# Altium schematic sheet PwrAndBias.SchDoc: XTRX. SDR mini PCIe Transceiver.
size A3; CompanyName: Fairwaves Inc.; DrawnBy: Andrey Sviyazov; Revision: 4; SheetNumber: 4; SheetTotal: 5
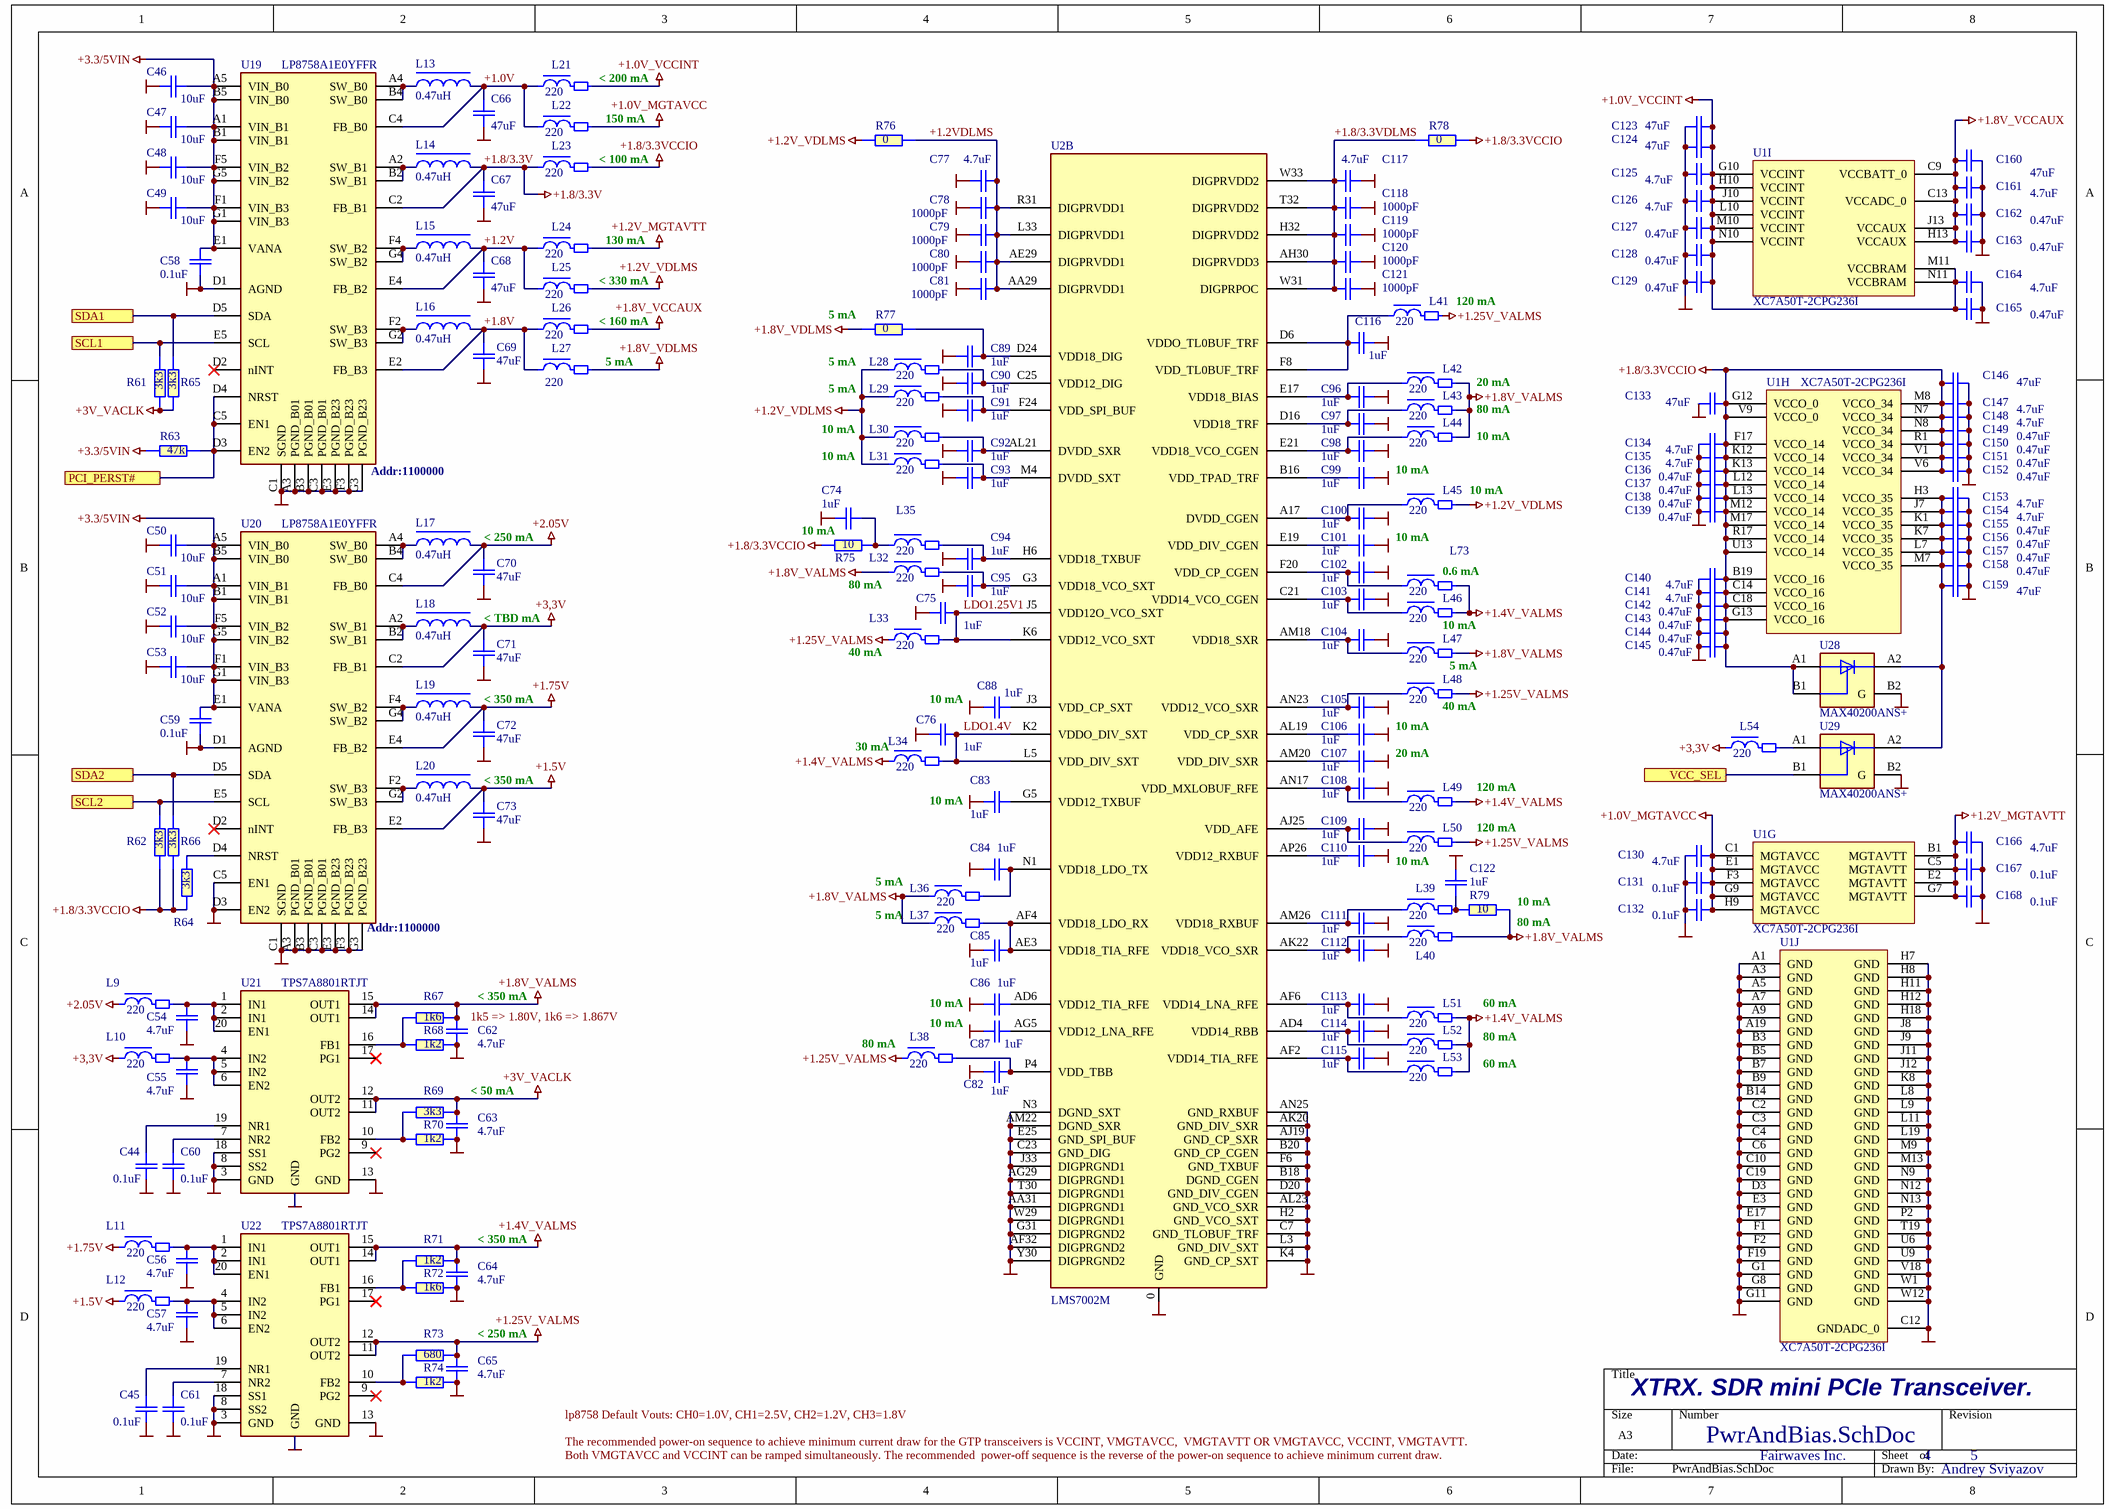
[diagram p0: PwrAndBias.SchDoc]

## Parts
C44  0.1uF  [C0402-cirq]
C45  0.1uF  [C0402-cirq]
C46  10uF  [C0603-Phillips]
C47  10uF  [C0603-Phillips]
C48  10uF  [C0603-Phillips]
C49  10uF  [C0603-Phillips]
C50  10uF  [C0603-Phillips]
C51  10uF  [C0603-Phillips]
C52  10uF  [C0603-Phillips]
C53  10uF  [C0603-Phillips]
C54  4.7uF  [C0402-cirq]
C55  4.7uF  [C0402-cirq]
C56  4.7uF  [C0402-cirq]
C57  4.7uF  [C0402-cirq]
C58  0.1uF  [C0402-cirq]
C59  0.1uF  [C0402-cirq]
C60  0.1uF  [C0402-cirq]
C61  0.1uF  [C0402-cirq]
C62  4.7uF  [C0402-cirq]
C63  4.7uF  [C0402-cirq]
C64  4.7uF  [C0402-cirq]
C65  4.7uF  [C0402-cirq]
C66  47uF  [C0603 tall]
C67  47uF  [C0603 tall]
C68  47uF  [C0603 tall]
C69  47uF  [C0603 tall]
C70  47uF  [C0603 tall]
C71  47uF  [C0603 tall]
C72  47uF  [C0603 tall]
C73  47uF  [C0603 tall]
C74  1uF  [C0402-cirq]
C75  1uF  [C0402-cirq]
C76  1uF  [C0402-cirq]
C77  4.7uF  [C0402-cirq]
C78  1000pF  [C0402-cirq]
C79  1000pF  [C0402-cirq]
C80  1000pF  [C0402-cirq]
C81  1000pF  [C0402-cirq]
C82  1uF  [C0402-cirq]
C83  1uF  [C0402-cirq]
C84  1uF  [C0402-cirq]
C85  1uF  [C0402-cirq]
C86  1uF  [C0402-cirq]
C87  1uF  [C0402-cirq]
C88  1uF  [C0402-cirq]
C89  1uF  [C0402-cirq]
C90  1uF  [C0402-cirq]
C91  1uF  [C0402-cirq]
C92  1uF  [C0402-cirq]
C93  1uF  [C0402-cirq]
C94  1uF  [C0402-cirq]
C95  1uF  [C0402-cirq]
C96  1uF  [C0402-cirq]
C97  1uF  [C0402-cirq]
C98  1uF  [C0402-cirq]
C99  1uF  [C0402-cirq]
C100  1uF  [C0402-cirq]
C101  1uF  [C0402-cirq]
C102  1uF  [C0402-cirq]
C103  1uF  [C0402-cirq]
C104  1uF  [C0402-cirq]
C105  1uF  [C0402-cirq]
C106  1uF  [C0402-cirq]
C107  1uF  [C0402-cirq]
C108  1uF  [C0402-cirq]
C109  1uF  [C0402-cirq]
C110  1uF  [C0402-cirq]
C111  1uF  [C0402-cirq]
C112  1uF  [C0402-cirq]
C113  1uF  [C0402-cirq]
C114  1uF  [C0402-cirq]
C115  1uF  [C0402-cirq]
C116  1uF  [C0402-cirq]
C117  4.7uF  [C0402-cirq]
C118  1000pF  [C0402-cirq]
C119  1000pF  [C0402-cirq]
C120  1000pF  [C0402-cirq]
C121  1000pF  [C0402-cirq]
C122  1uF  [C0402-cirq]
C123  47uF  [C0603 tall]
C124  47uF  [C0603 tall]
C125  4.7uF  [C0402-cirq]
C126  4.7uF  [C0402-cirq]
C127  0.47uF  [C0402-cirq]
C128  0.47uF  [C0402-cirq]
C129  0.47uF  [C0402-cirq]
C130  4.7uF  [C0402-cirq]
C131  0.1uF  [C0402-cirq]
C132  0.1uF  [C0402-cirq]
C133  47uF  [C0603 tall]
C134  4.7uF  [C0402-cirq]
C135  4.7uF  [C0402-cirq]
C136  0.47uF  [C0402-cirq]
C137  0.47uF  [C0402-cirq]
C138  0.47uF  [C0402-cirq]
C139  0.47uF  [C0402-cirq]
C140  4.7uF  [C0402-cirq]
C141  4.7uF  [C0402-cirq]
C142  0.47uF  [C0402-cirq]
C143  0.47uF  [C0402-cirq]
C144  0.47uF  [C0402-cirq]
C145  0.47uF  [C0402-cirq]
C146  47uF  [C0603 tall]
C147  4.7uF  [C0402-cirq]
C148  4.7uF  [C0402-cirq]
C149  0.47uF  [C0402-cirq]
C150  0.47uF  [C0402-cirq]
C151  0.47uF  [C0402-cirq]
C152  0.47uF  [C0402-cirq]
C153  4.7uF  [C0402-cirq]
C154  4.7uF  [C0402-cirq]
C155  0.47uF  [C0402-cirq]
C156  0.47uF  [C0402-cirq]
C157  0.47uF  [C0402-cirq]
C158  0.47uF  [C0402-cirq]
C159  47uF  [C0603 tall]
C160  47uF  [C0603 tall]
C161  4.7uF  [C0402-cirq]
C162  0.47uF  [C0402-cirq]
C163  0.47uF  [C0402-cirq]
C164  4.7uF  [C0402-cirq]
C165  0.47uF  [C0402-cirq]
C166  4.7uF  [C0402-cirq]
C167  0.1uF  [C0402-cirq]
C168  0.1uF  [C0402-cirq]
L9  220  [BEAD0402-Phillips]
L10  220  [BEAD0402-Phillips]
L11  220  [BEAD0402-Phillips]
L12  220  [BEAD0402-Phillips]
L13  0.47uH  [L-VLS201610HBX]
L14  0.47uH  [L-VLS201610HBX]
L15  0.47uH  [L-VLS201610HBX]
L16  0.47uH  [L-VLS201610HBX]
L17  0.47uH  [L-VLS201610HBX]
L18  0.47uH  [L-VLS201610HBX]
L19  0.47uH  [L-VLS201610HBX]
L20  0.47uH  [L-VLS201610HBX]
L21  220  [BEAD0402-Phillips]
L22  220  [BEAD0402-Phillips]
L23  220  [BEAD0402-Phillips]
L24  220  [BEAD0402-Phillips]
L25  220  [BEAD0402-Phillips]
L26  220  [BEAD0402-Phillips]
L27  220  [BEAD0402-Phillips]
L28  220  [BEAD0402-Phillips]
L29  220  [BEAD0402-Phillips]
L30  220  [BEAD0402-Phillips]
L31  220  [BEAD0402-Phillips]
L32  220  [BEAD0402-Phillips]
L33  220  [BEAD0402-Phillips]
L34  220  [BEAD0402-Phillips]
L35  220  [BEAD0402-Phillips]
L36  220  [BEAD0402-Phillips]
L37  220  [BEAD0402-Phillips]
L38  220  [BEAD0402-Phillips]
L39  220  [BEAD0402-Phillips]
L40  220  [BEAD0402-Phillips]
L41  220  [BEAD0402-Phillips]
L42  220  [BEAD0402-Phillips]
L43  220  [BEAD0402-Phillips]
L44  220  [BEAD0402-Phillips]
L45  220  [BEAD0402-Phillips]
L46  220  [BEAD0402-Phillips]
L47  220  [BEAD0402-Phillips]
L48  220  [BEAD0402-Phillips]
L49  220  [BEAD0402-Phillips]
L50  220  [BEAD0402-Phillips]
L51  220  [BEAD0402-Phillips]
L52  220  [BEAD0402-Phillips]
L53  220  [BEAD0402-Phillips]
L54  220  [BEAD0402-Phillips]
L73  220  [BEAD0402-Phillips]
R61  3k3  [R0402-Phillips]
R62  3k3  [R0402-Phillips]
R63  47k  [R0402-Phillips]
R64  3k3  [R0402-Phillips]
R65  3k3  [R0402-Phillips]
R66  3k3  [R0402-Phillips]
R67  1k6  [R0402-Phillips]
R68  1k2  [R0402-Phillips]
R69  3k3  [R0402-Phillips]
R70  1k2  [R0402-Phillips]
R71  1k2  [R0402-Phillips]
R72  1k6  [R0402-Phillips]
R73  680  [R0402-Phillips]
R74  1k2  [R0402-Phillips]
R75  10  [R0402-Phillips]
R76  0  [R0402-Phillips]
R77  0  [R0402-Phillips]
R78  0  [R0402-Phillips]
R79  10  [R0402-Phillips]
U1  XC7A50T-2CPG236I  [CPG236]  (parts G,H,I,J of 10)
U2  LMS7002M  [aQFN260(11.5x11.5mm)]  (part B of 5)
U19  LP8758A1E0YFFR  [BGA WLCSP35]
U20  LP8758A1E0YFFR  [BGA WLCSP35]
U21  TPS7A8801RTJT  [QFN-20(4X4/0.5)TI]
U22  TPS7A8801RTJT  [QFN-20(4X4/0.5)TI]
U28  MAX40200ANS+  [BGA WLP4 (0.7x0.7/0.35)]
U29  MAX40200ANS+  [BGA WLP4 (0.7x0.7/0.35)]

## Ports
PCI_PERST#, SCL1, SCL2, SDA1, SDA2, VCC_SEL

## Nets
+1.0V_MGTAVCC: C130.2 C131.1 C132.1 L22.2 U1.C1(MGTAVCC) U1.E1(MGTAVCC) U1.F3(MGTAVCC) U1.G9(MGTAVCC) U1.H9(MGTAVCC)
+1.0V_VCCINT: C123.2 C124.2 C125.1 C126.1 C127.1 C128.1 C129.1 C164.1 C165.1 L21.2 U1.G10(VCCINT) U1.H10(VCCINT) U1.J10(VCCINT) U1.L10(VCCINT) U1.M10(VCCINT) U1.M11(VCCBRAM) U1.N10(VCCINT) U1.N11(VCCBRAM)
+1.2V_MGTAVTT: C166.1 C167.1 C168.1 L24.2 U1.B1(MGTAVTT) U1.C5(MGTAVTT) U1.E2(MGTAVTT) U1.G7(MGTAVTT)
+1.2V_VDLMS: L25.2 L28.1 L29.1 L30.1 L31.1 L45.2 R76.1
+1.4V_VALMS: C64.2 L34.1 L46.2 L49.2 L51.2 L52.2 L53.2 L73.2 R71.2 U22.14(OUT1) U22.15(OUT1)
+1.5V: C73.2 L12.1 L20.2 U20.E2(FB_B3)
+1.8/3.3V: C67.2 L14.2 L23.1 U19.C2(FB_B1)
+1.8/3.3VCCIO: C133.2 C134.1 C135.1 C136.1 C137.1 C138.1 C139.1 C140.1 C141.1 C142.1 C143.1 C144.1 C145.1 C146.1 C147.1 C148.1 C149.1 C150.1 C151.1 C152.1 L23.2 R62.1 R64.1 R66.1 R75.1 R78.2 U1.B19(VCCO_16) U1.C14(VCCO_16) U1.C18(VCCO_16) U1.F17(VCCO_14) U1.G12(VCCO_0) U1.G13(VCCO_16) U1.K12(VCCO_14) U1.K13(VCCO_14) U1.L12(VCCO_14) U1.L13(VCCO_14) U1.M8(VCCO_34) U1.M12(VCCO_14) U1.M17(VCCO_14) U1.N7(VCCO_34) U1.N8(VCCO_34) U1.R1(VCCO_34) U1.R17(VCCO_14) U1.U13(VCCO_14) U1.V1(VCCO_34) U1.V6(VCCO_34) U1.V9(VCCO_0) U28.A1(VDD) U28.B1(EN)
+1.8V_VALMS: C62.2 L32.1 L36.1 L37.1 L40.2 L42.2 L43.2 L44.2 L47.2 R67.2 R79.2 U21.14(OUT1) U21.15(OUT1)
+1.8V_VCCAUX: C160.1 C161.1 C162.1 C163.1 L26.2 U1.C9(VCCBATT_0) U1.C13(VCCADC_0) U1.H13(VCCAUX) U1.J13(VCCAUX)
+1.8V_VDLMS: L27.2 R77.1
+1.25V_VALMS: C65.2 L33.1 L38.1 L41.2 L48.2 L50.2 R73.2 U22.11(OUT2) U22.12(OUT2)
+1.75V: C72.2 L11.1 L19.2 U20.E4(FB_B2)
+2.05V: C70.2 L9.1 L17.2 U20.C4(FB_B0)
+3,3V: C71.2 L10.1 L18.2 L54.1 U20.C2(FB_B1)
+3.3/5VIN: C46.2 C47.2 C48.2 C49.2 C50.2 C51.2 C52.2 C53.2 C58.2 C59.2 R63.1 U19.A1(VIN_B1) U19.A5(VIN_B0) U19.B1(VIN_B1) U19.B5(VIN_B0) U19.E1(VANA) U19.F1(VIN_B3) U19.F5(VIN_B2) U19.G1(VIN_B3) U19.G5(VIN_B2) U20.A1(VIN_B1) U20.A5(VIN_B0) U20.B1(VIN_B1) U20.B5(VIN_B0) U20.E1(VANA) U20.F1(VIN_B3) U20.F5(VIN_B2) U20.G1(VIN_B3) U20.G5(VIN_B2)
+3V_VACLK: C63.2 R61.1 R65.1 R69.2 U21.11(OUT2) U21.12(OUT2)
GND: C44.1 C45.1 C46.1 C47.1 C48.1 C49.1 C50.1 C51.1 C52.1 C53.1 C54.1 C55.1 C56.1 C57.1 C58.1 C59.1 C60.1 C61.1 C62.1 C63.1 C64.1 C65.1 C66.2 C67.1 C68.2 C69.1 C70.1 C71.1 C72.1 C73.1 C74.1 C75.1 C76.1 C77.1 C78.1 C79.1 C80.1 C81.1 C82.1 C83.1 C84.1 C85.1 C86.1 C87.1 C88.1 C89.1 C90.1 C91.1 C92.1 C93.1 C94.1 C95.1 C96.2 C97.2 C98.2 C99.2 C100.2 C101.2 C102.2 C103.2 C104.2 C105.2 C106.2 C107.2 C108.2 C109.2 C110.2 C111.2 C112.2 C113.2 C114.2 C115.2 C116.2 C117.2 C118.1 C119.1 C120.1 C121.1 C122.2 C123.1 C124.1 C125.2 C126.2 C127.2 C128.2 C129.2 C130.1 C131.2 C132.2 C133.1 C134.2 C135.2 C136.2 C137.2 C138.2 C139.2 C140.2 C141.2 C142.2 C143.2 C144.2 C145.2 C146.2 C147.2 C148.2 C149.2 C150.2 C151.2 C152.2 C153.2 C154.2 C155.2 C156.2 C157.2 C158.2 C159.2 C160.2 C161.2 C162.2 C163.2 C164.2 C165.2 C166.2 C167.2 C168.2 R68.2 R70.2 R72.2 R74.2 U1.A1(GND) U1.A3(GND) U1.A5(GND) U1.A7(GND) U1.A9(GND) U1.A19(GND) U1.B3(GND) U1.B5(GND) U1.B7(GND) U1.B9(GND) U1.B14(GND) U1.C2(GND) U1.C3(GND) U1.C4(GND) U1.C6(GND) U1.C10(GND) U1.C12(GNDADC_0) U1.C19(GND) U1.D3(GND) U1.E3(GND) U1.E17(GND) U1.F1(GND) U1.F2(GND) U1.F19(GND) U1.G1(GND) U1.G8(GND) U1.G11(GND) U1.H7(GND) U1.H8(GND) U1.H11(GND) U1.H12(GND) U1.H18(GND) U1.J8(GND) U1.J9(GND) U1.J11(GND) U1.J12(GND) U1.K8(GND) U1.L8(GND) U1.L9(GND) U1.L11(GND) U1.L19(GND) U1.M9(GND) U1.M13(GND) U1.N9(GND) U1.N12(GND) U1.N13(GND) U1.P2(GND) U1.T19(GND) U1.U6(GND) U1.U9(GND) U1.V18(GND) U1.W1(GND) U1.W12(GND) U2.0(GND) U2.AA31(DIGPRGND1) U2.AF32(DIGPRGND2) U2.AG29(DIGPRGND1) U2.AJ19(GND_CP_SXR) U2.AK20(GND_DIV_SXR) U2.AL23(GND_VCO_SXR) U2.AM22(DGND_SXR) U2.AN25(GND_RXBUF) U2.B18(DGND_CGEN) U2.B20(GND_CP_CGEN) U2.C7(GND_TLOBUF_TRF) U2.C23(GND_DIG) U2.D20(GND_DIV_CGEN) U2.E25(GND_SPI_BUF) U2.F6(GND_TXBUF) U2.G31(DIGPRGND2) U2.H2(GND_VCO_SXT) U2.J33(DIGPRGND1) U2.K4(GND_CP_SXT) U2.L3(GND_DIV_SXT) U2.N3(DGND_SXT) U2.T30(DIGPRGND1) U2.W29(DIGPRGND1) U2.Y30(DIGPRGND2) U19.A3(PGND_B01) U19.B3(PGND_B01) U19.C1(SGND) U19.C3(PGND_B01) U19.D1(AGND) U19.E3(PGND_B23) U19.F3(PGND_B23) U19.G3(PGND_B23) U20.A3(PGND_B01) U20.B3(PGND_B01) U20.C1(SGND) U20.C3(PGND_B01) U20.C5(EN1) U20.D1(AGND) U20.D3(EN2) U20.E3(PGND_B23) U20.F3(PGND_B23) U20.G3(PGND_B23) U21.0(GND) U21.3(GND) U21.8(SS2) U21.13(GND) U21.18(SS1) U22.0(GND) U22.3(GND) U22.8(SS2) U22.13(GND) U22.18(SS1) U28.B2(G) U29.B2(G)
+1.0V: C66.1 L13.2 L21.1 L22.1 U19.C4(FB_B0)
+1.2V: C68.1 L15.2 L24.1 L25.1 U19.E4(FB_B2)
+1.2VDLMS: C77.2 C78.2 C79.2 C80.2 C81.2 R76.2 U2.AA29(DIGPRVDD1) U2.AE29(DIGPRVDD1) U2.L33(DIGPRVDD1) U2.R31(DIGPRVDD1)
+1.8/3.3VDLMS: C117.1 C118.2 C119.2 C120.2 C121.2 R78.1 U2.AH30(DIGPRVDD3) U2.H32(DIGPRVDD2) U2.T32(DIGPRVDD2) U2.W31(DIGPRPOC) U2.W33(DIGPRVDD2)
+1.8V: C69.2 L16.2 L26.1 L27.1 U19.E2(FB_B3)
LDO1.4V: C76.2 L34.2 U2.K2(VDDO_DIV_SXT) U2.L5(VDD_DIV_SXT)
LDO1.25V1: C75.2 L33.2 U2.J5(VDD12O_VCO_SXT) U2.K6(VDD12_VCO_SXT)
PCI_PERST#: R63.2 U19.C5(EN1) U19.D3(EN2) U19.D4(NRST) ; port PCI_PERST#
SCL1: R61.2 U19.E5(SCL) ; port SCL1
SCL2: R62.2 U20.E5(SCL) ; port SCL2
SDA1: R65.2 U19.D5(SDA) ; port SDA1
SDA2: R66.2 U20.D5(SDA) ; port SDA2
VCC_SEL: U29.B1(EN) ; port VCC_SEL
NetC44_2: C44.2 U21.19(NR1)
NetC45_2: C45.2 U22.19(NR1)
NetC54_2: C54.2 L9.2 U21.1(IN1) U21.2(IN1) U21.20(EN1)
NetC55_2: C55.2 L10.2 U21.4(IN2) U21.5(IN2) U21.6(EN2)
NetC56_2: C56.2 L11.2 U22.1(IN1) U22.2(IN1) U22.20(EN1)
NetC57_2: C57.2 L12.2 U22.4(IN2) U22.5(IN2) U22.6(EN2)
NetC60_2: C60.2 U21.7(NR2)
NetC61_2: C61.2 U22.7(NR2)
NetC74_2: C74.2 L35.1 R75.2
NetC82_2: C82.2 L38.2 U2.P4(VDD_TBB)
NetC83_2: C83.2 U2.G5(VDD12_TXBUF)
NetC84_2: C84.2 L36.2 U2.N1(VDD18_LDO_TX)
NetC85_2: C85.2 L37.2 U2.AE3(VDD18_TIA_RFE) U2.AF4(VDD18_LDO_RX)
NetC86_2: C86.2 U2.AD6(VDD12_TIA_RFE)
NetC87_2: C87.2 U2.AG5(VDD12_LNA_RFE)
NetC88_2: C88.2 U2.J3(VDD_CP_SXT)
NetC89_2: C89.2 R77.2 U2.D24(VDD18_DIG)
NetC90_2: C90.2 L28.2 U2.C25(VDD12_DIG)
NetC91_2: C91.2 L29.2 U2.F24(VDD_SPI_BUF)
NetC92_2: C92.2 L30.2 U2.AL21(DVDD_SXR)
NetC93_2: C93.2 L31.2 U2.M4(DVDD_SXT)
NetC94_2: C94.2 L35.2 U2.H6(VDD18_TXBUF)
NetC95_2: C95.2 L32.2 U2.G3(VDD18_VCO_SXT)
NetC96_1: C96.1 L42.1 U2.E17(VDD18_BIAS)
NetC97_1: C97.1 L43.1 U2.D16(VDD18_TRF)
NetC98_1: C98.1 L44.1 U2.E21(VDD18_VCO_CGEN)
NetC99_1: C99.1 U2.B16(VDD_TPAD_TRF)
NetC100_1: C100.1 L45.1 U2.A17(DVDD_CGEN)
NetC101_1: C101.1 U2.E19(VDD_DIV_CGEN)
NetC102_1: C102.1 L73.1 U2.F20(VDD_CP_CGEN)
NetC103_1: C103.1 L46.1 U2.C21(VDD14_VCO_CGEN)
NetC104_1: C104.1 L47.1 U2.AM18(VDD18_SXR)
NetC105_1: C105.1 L48.1 U2.AN23(VDD12_VCO_SXR)
NetC106_1: C106.1 U2.AL19(VDD_CP_SXR)
NetC107_1: C107.1 U2.AM20(VDD_DIV_SXR)
NetC108_1: C108.1 L49.1 U2.AN17(VDD_MXLOBUF_RFE)
NetC109_1: C109.1 L50.1 U2.AJ25(VDD_AFE)
NetC110_1: C110.1 U2.AP26(VDD12_RXBUF)
NetC111_1: C111.1 L39.1 U2.AM26(VDD18_RXBUF)
NetC112_1: C112.1 L40.1 U2.AK22(VDD18_VCO_SXR)
NetC113_1: C113.1 L51.1 U2.AF6(VDD14_LNA_RFE)
NetC114_1: C114.1 L52.1 U2.AD4(VDD14_RBB)
NetC115_1: C115.1 L53.1 U2.AF2(VDD14_TIA_RFE)
NetC116_1: C116.1 L41.1 U2.D6(VDDO_TL0BUF_TRF) U2.F8(VDD_TL0BUF_TRF)
NetC122_1: C122.1 L39.2 R79.1
NetC153_1: C153.1 C154.1 C155.1 C156.1 C157.1 C158.1 C159.1 U1.H3(VCCO_35) U1.J7(VCCO_35) U1.K1(VCCO_35) U1.K7(VCCO_35) U1.L7(VCCO_35) U1.M7(VCCO_35) U28.A2(OUT) U29.A2(OUT)
NetL13_1: L13.1 U19.A4(SW_B0) U19.B4(SW_B0)
NetL14_1: L14.1 U19.A2(SW_B1) U19.B2(SW_B1)
NetL15_1: L15.1 U19.F4(SW_B2) U19.G4(SW_B2)
NetL16_1: L16.1 U19.F2(SW_B3) U19.G2(SW_B3)
NetL17_1: L17.1 U20.A4(SW_B0) U20.B4(SW_B0)
NetL18_1: L18.1 U20.A2(SW_B1) U20.B2(SW_B1)
NetL19_1: L19.1 U20.F4(SW_B2) U20.G4(SW_B2)
NetL20_1: L20.1 U20.F2(SW_B3) U20.G2(SW_B3)
NetL54_2: L54.2 U29.A1(VDD)
NetR64_2: R64.2 U20.D4(NRST)
NetR67_1: R67.1 R68.1 U21.16(FB1)
NetR69_1: R69.1 R70.1 U21.10(FB2)
NetR71_1: R71.1 R72.1 U22.16(FB1)
NetR73_1: R73.1 R74.1 U22.10(FB2)

Not connected (* = marked no-connect by the designer): U19 D2(nINT)*; U20 D2(nINT)*; U21 9(PG2)* 17(PG1)*; U22 9(PG2)* 17(PG1)*

## Notes on the sheet
- (near L21) < 200 mA
- (near L23) < 100 mA
- (near L22) 150 mA
- (near L24) 130 mA
- (near L25) < 330 mA
- (near R77) 5 mA
- (near L41) 120 mA
- (near L26) < 160 mA
- (near L27) 5 mA
- 5 mA
- 10 mA
- 20 mA
- 80 mA
- (near U19) Addr:1100000
- (near L45) 10 mA
- < 250 mA
- (near L32) 80 mA
- (near L73) 0.6 mA
- < TBD mA
- (near L46) 10 mA
- < 350 mA
- (near L33) 40 mA
- (near L48) 40 mA
- (near L47) 5 mA
- (near L34) 30 mA
- (near L49) 120 mA
- 120 mA
- (near R79) 10 mA
- (near U20) Addr:1100000
- (near R79) 80 mA
- 1k5 => 1.80V, 1k6 => 1.867V
- (near L38) 80 mA
- 60 mA
- < 50 mA
- The recommended power-on sequence to achieve minimum current draw for the GTP transceivers is VCCINT, VMGTAVCC,  VMGTAVTT OR VMGTAVCC, VCCINT, VMGTAVTT.
- Both VMGTAVCC and VCCINT can be ramped simultaneously. The recommended  power-off sequence is the reverse of the power-on sequence to achieve minimum current draw.
- lp8758 Default Vouts: CH0=1.0V, CH1=2.5V, CH2=1.2V, CH3=1.8V

## Library data of the parts
C44 C45 C58-C61 C131 C132 C167 C168 = C0402: Capacitor; Manufacturer: Any; Tolerance: 20%; Name: SMD0402; U/P/TKE: X7R 16V; Value: 0.1uF; Link: https://octopart.com/search?avg_avail=%281__%2A%29&q=GRM155+x7r+0.1uf+0402&r=sp&s=NUEPno7bQ4qfu1XPud9uDg&start=10
C46-C53 = C0603: Capacitor; Manufacturer: Any; Tolerance: 20%; U/P/TKE: X5R 6.3V; Value: 10uF; Link: https://octopart.com/search?avg_avail=(1__*)&q=10uF%20%20x5r%206.3v%200603&start=0
C54-C57 C62-C65 C77 C117 C125 C126 C130 C134 C135 C140 C141 C147 C148 C153 C154 C161 C164 C166 = C0402: Capacitor; Manufacturer: Any; Tolerance: 20%; Name: SMD0402; U/P/TKE: X5R 6.3V; Value: 4.7uF; Link: https://octopart.com/search?avg_avail=(1__*)&q=4.7uf%200402&start=0&specs2.76.numbers=4.7e-06
C66-C73 C123 C124 C133 C146 C159 C160 = C0603-TALL: Capacitor; Manufacturer: MuRata; Tolerance: 20%; Name: ZRB18AR60J476ME01L; U/P/TKE: X5R 6.3V; Value: 47uF; Link: https://octopart.com/zrb18ar60j476me01l-murata-71221023?r=sp&s=AX1jIhZnRzqCJDNKo8E3Og
C74-C76 C82-C116 C122 = C0402: Capacitor; Manufacturer: Any; Tolerance: 20%; Name: SMD0402; U/P/TKE: X5R 10V; Value: 1uF; Link: https://octopart.com/search?avg_avail=(1__*)&q=1uF%20%20x5r%200402&specs2.76.numbers=1e-06&start=0&oq=1uF%20%20x5r%200402
C78-C81 C118-C121 = C0402: Capacitor; Manufacturer: Any; Tolerance: 10%; Name: SMD0402; U/P/TKE: C0G NP0; Value: 1000pF; Link: https://octopart.com/search?avg_avail=(1__*)&q=1000PF%20C0G%20NP0%200402&start=0
C127-C129 C136-C139 C142-C145 C149-C152 C155-C158 C162 C163 C165 = C0402: Capacitor; Manufacturer: Any; Tolerance: 20%; Name: SMD0402; U/P/TKE: X5R 16V; Value: 0.47uF; Link: https://octopart.com/search?avg_avail=(1__*)&q=x5r%200.47uf%200402&r=sp&s=NUEPno7bQ4qfu1XPud9uDg&start=0
L9-L12 L21-L54 L73 = EMI BLM15: Ferrite bead EMIFIL; Manufacturer: MURATA; Name: BLM15EG221SN1; Value: 220; Link: https://octopart.com/blm15eg221sn1d-murata-368376
L13-L20 = L-VLS20161xHBX-1: Coil; Manufacturer: TDK; U/P/TKE: 2.8A/35mOhm; Name: VLS201610HBX-R47M-1; Value: 0.47uH; Link: https://octopart.com/vls201610hbx-r47m-1-tdk-52458594
R61-R79 = R0402: Resistor; Manufacturer: BOURNS; Tolerance: 5%; Name: CR0402-JW; U/P/TKE: 50V/60mW/200ppm
  R61 R62 R64-R66 R69: Value: 3k3
  R63: Value: 47k
  R67 R72: Value: 1k6
  R68 R70 R71 R74: Value: 1k2
  R73: Value: 680
  R75 R79: Value: 10
  R76-R78: Value: 0
U1 = XC7A35T-2CPG236C: Artix-7 FPGA; Manufacturer: Xilinx; Total Block RAM: 1800 Kb; GTP: 2; Clock Mgmt Tiles (CMTs): 5; Logic Cells: 33280; Available User I/O: 106; DatasheetVersion: v1.15; PackageVersion: Rev. 1.11; PackageReference: CPG-236; PackageDescription: 238-Ball Wire-Bond Chip-Scale BGA, Body 10 x10 mm, Pitch 0.5 mm; Maximum Distributed RAM: 400 Kb; Operating Temperature Range: Commercial; Speed Grades: 2; NexusDeviceID: XC7A35T-2CPG236C; Mounting Technology: Surface Mount; PartNumber: XC7A50T-2CPG236I; ComponentLink1Description: Manufacturer URL; ComponentLink1URL: http://www.xilinx.com/; ComponentLink2Description: Datasheet; ComponentLink2URL: http://www.xilinx.com/support/documentation/data_sheets/ds180_7Series_Overview.pdf; ComponentLink3Description: Package Specification; ComponentLink3URL: http://www.xilinx.com/support/documentation/user_guides/ug475_7Series_Pkg_Pinout.pdf; ComponentLink4Description: DC and Switching Characteristics; ComponentLink4URL: http://www.xilinx.com/support/documentation/data_sheets/ds181_Artix_7_Data_Sheet.pdf; ComponentLink5Description: Package File; ComponentLink5URL: http://www.xilinx.com/support/packagefiles/a7packages/xc7a200tsbg484pkg.txt; ComponentLink6Description: Packaging and Pinout; ComponentLink6URL: http://www.xilinx.com/support/documentation/user_guides/ug475_7Series_Pkg_Pinout.pdf
U2 = LMS7002M: FPRF MIMO Transceiver IC; Manufacturer: Lime Microsystems; Misc: Multi-band Multi-standard  Transceiver with Digital Interface; Name: LMS7002M
U19 U20 = LP8758-E0: IC 4xDC/DC; Manufacturer: TI; Misc: 4x  4A DC/DCs, i2c control; Swap: No; U/P/TKE: 2.5-5.5V to 0.5-3.3V; Name: LP8758A1E0YFFR; Link: https://octopart.com/lp8758a1e0yffr-texas+instruments-68058967
U21 U22 = TPS7A88: IC dual LDO extra low noise; Manufacturer: TI; Swap: No; U/P/TKE: 1.4-6.5V/Vdo<0.2V/NF<3.8uVrms; Name: TPS7A8801RTJT; Link: https://octopart.com/tps7a8801rtjt-texas+instruments-68059618
U28 U29 = MAX40200ANS+: IC ideal diode switch; Manufacturer: MAXIM; U/P/TKE: 1.5-5.5V/1A; Name: MAX40200ANS+; Misc: IC ideal diode switch; Value: MAX40200ANS+; Link: https://octopart.com/max40200ans%2Bt-maxim+integrated-80998950